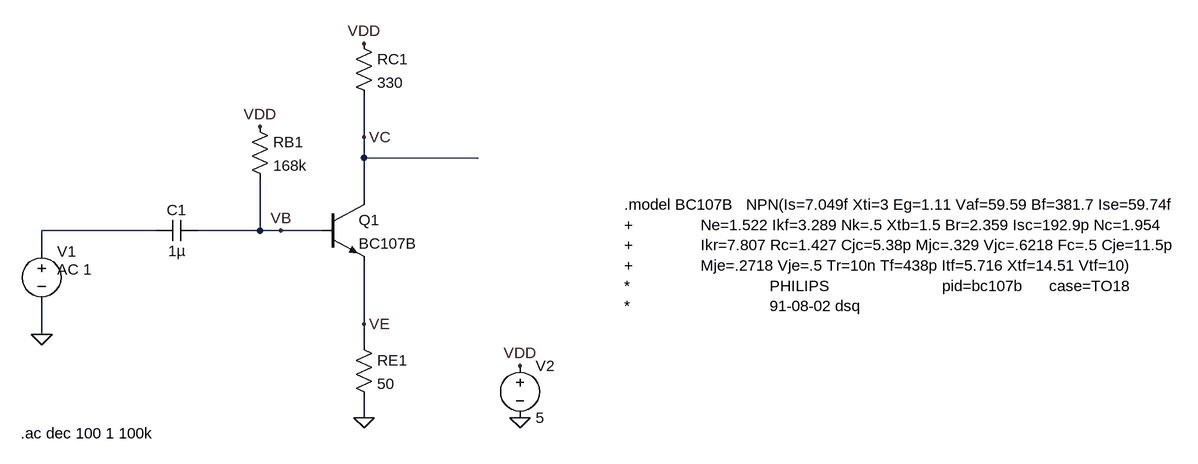
[diagram p0: schematic Draft1.asc]
Draft1.asc, the LTspice schematic file:
Version 4
SHEET 1 1320 680
WIRE -16 0 -16 -64
WIRE -16 32 -16 0
WIRE 160 32 -16 32
WIRE -16 96 -16 32
WIRE -336 144 -512 144
WIRE -176 144 -176 64
WIRE -176 144 -272 144
WIRE -144 144 -176 144
WIRE -80 144 -144 144
WIRE -512 176 -512 144
WIRE -16 288 -16 192
WIRE -512 304 -512 256
WIRE -16 320 -16 288
WIRE -16 432 -16 400
FLAG -512 304 0
FLAG -16 432 0
FLAG 224 432 0
FLAG 224 352 VDD
FLAG -16 -144 VDD
FLAG -176 -16 VDD
FLAG -144 144 VB
FLAG -16 288 VE
FLAG -16 0 VC
SYMBOL npn -80 96 R0
SYMATTR InstName Q1
SYMATTR Value BC107B
SYMBOL cap -272 128 R90
WINDOW 0 0 32 VBottom 2
WINDOW 3 32 32 VTop 2
SYMATTR InstName C1
SYMATTR Value 1µ
SYMBOL res -192 -32 R0
SYMATTR InstName RB1
SYMATTR Value 168k
SYMBOL res -32 -160 R0
SYMATTR InstName RC1
SYMATTR Value 330
SYMBOL res -32 304 R0
SYMATTR InstName RE1
SYMATTR Value 50
SYMBOL voltage -512 160 R0
WINDOW 123 24 44 Left 2
WINDOW 39 0 0 Left 0
SYMATTR Value2 AC 1
SYMATTR InstName V1
SYMATTR Value ""
SYMBOL voltage 224 336 R0
WINDOW 123 0 0 Left 0
WINDOW 39 0 0 Left 0
SYMATTR InstName V2
SYMATTR Value 5
TEXT -544 456 Left 2 !.ac dec 100 1 100k
TEXT 384 104 Left 2 !.model BC107B   NPN(Is=7.049f Xti=3 Eg=1.11 Vaf=59.59 Bf=381.7 Ise=59.74f\n+               Ne=1.522 Ikf=3.289 Nk=.5 Xtb=1.5 Br=2.359 Isc=192.9p Nc=1.954\n+               Ikr=7.807 Rc=1.427 Cjc=5.38p Mjc=.329 Vjc=.6218 Fc=.5 Cje=11.5p\n+               Mje=.2718 Vje=.5 Tr=10n Tf=438p Itf=5.716 Xtf=14.51 Vtf=10)\n*                               PHILIPS                         pid=bc107b      case=TO18\n*                               91-08-02 dsq

The netlist it stands for:
* Draft1.asc
Q1 VC VB VE 0 BC107B
C1 VB N001 1µ
RB1 VDD VB 168k
RC1 VDD VC 330
RE1 VE 0 50
V1 N001 0 AC 1
V2 VDD 0 5
.model NPN NPN
.model PNP PNP
.lib standard.bjt
.ac dec 100 1 100k
.model BC107B   NPN(Is=7.049f Xti=3 Eg=1.11 Vaf=59.59 Bf=381.7 Ise=59.74f
+               Ne=1.522 Ikf=3.289 Nk=.5 Xtb=1.5 Br=2.359 Isc=192.9p Nc=1.954
+               Ikr=7.807 Rc=1.427 Cjc=5.38p Mjc=.329 Vjc=.6218 Fc=.5 Cje=11.5p
+               Mje=.2718 Vje=.5 Tr=10n Tf=438p Itf=5.716 Xtf=14.51 Vtf=10)
*                               PHILIPS                         pid=bc107b      case=TO18
*                               91-08-02 dsq
.backanno
.end

* Results of the author's LTspice run, read from the files saved beside the schematic
* Operating Point, zero values left out:
*   V(vc) = 2.589 V
*   V(vb) = 1.081 V
*   V(ve) = 366.4 mV
*   V(vdd) = 5 V
*   Ic(Q1) = 7.305 mA
*   Ib(Q1) = 23.32 µA
*   Ie(Q1) = -7.328 mA
*   I(Re1) = 7.328 mA
*   I(Rc1) = 7.305 mA
*   I(Rb1) = 23.32 µA
*   I(V2) = -7.328 mA
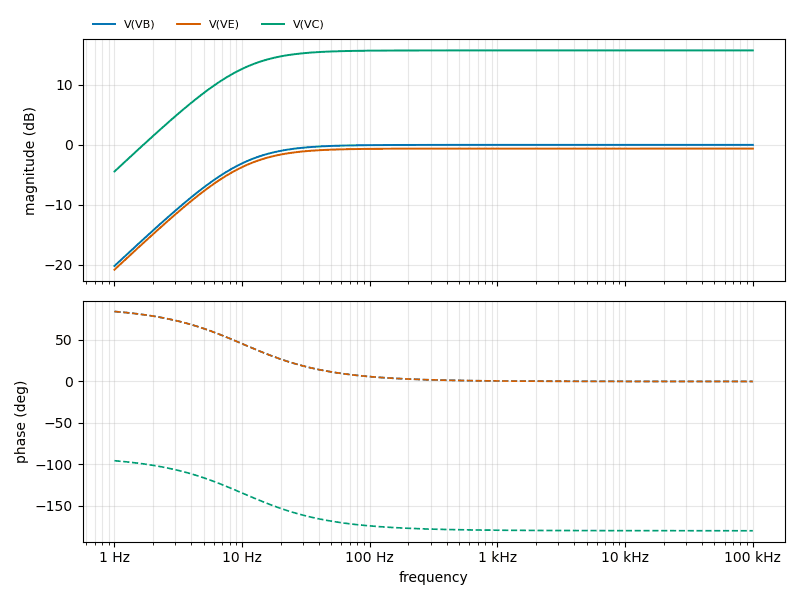
[diagram p1: AC Analysis of Draft1.asc, plotted from the saved traces]
* AC Analysis, 1 run:
*   V(VB): -20.19 dB at 1 Hz, -0.00 dB at 100 kHz, peak -0.00 dB at 100 kHz, 3 dB below the peak at 10.17 Hz
*   V(VE): -20.81 dB at 1 Hz, -0.62 dB at 100 kHz, peak -0.62 dB at 100 kHz, 3 dB below the peak at 10.17 Hz
*   V(VC): -4.44 dB at 1 Hz, 15.74 dB at 100 kHz, peak 15.74 dB at 37.15 kHz, 3 dB below the peak at 10.17 Hz